# EAGLE schematic MiddleRevolver (EAGLE 7.3.0)
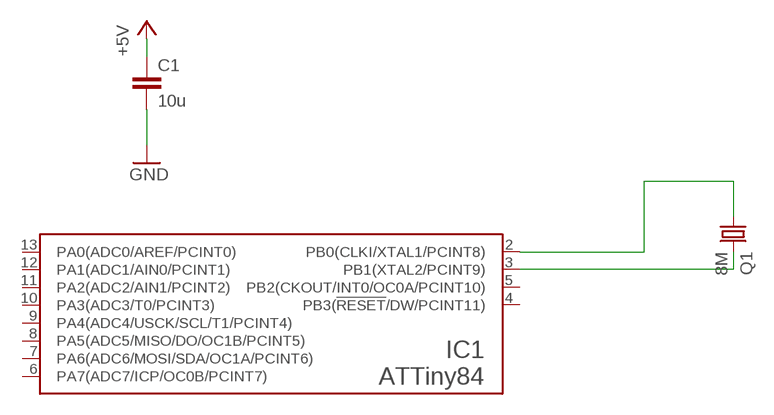
[diagram p0: schematic, sheet 1]

## Parts
C1  10u  C-EUC0805  [C0805]
IC1  ATTiny84  ATTINY24/44/84-PU  [DIL14]
Q1  8M  CRYSTALHC49S  [HC49/S]

## Nets
+5V: C1.1
GND: C1.2
N$1: IC1.2(PB0(CLKI/XTAL1/PCINT8)) Q1.1
N$2: IC1.3(PB1(XTAL2/PCINT9)) Q1.2
Unconnected: IC1.4(PB3(!RESET!/DW/PCINT11)) IC1.5(PB2(CKOUT/INT0/OC0A/PCINT10)) IC1.6(PA7(ADC7/ICP/OC0B/PCINT7)) IC1.7(PA6(ADC6/MOSI/SDA/OC1A/PCINT6)) IC1.8(PA5(ADC5/MISO/DO/OC1B/PCINT5)) IC1.9(PA4(ADC4/USCK/SCL/T1/PCINT4)) IC1.10(PA3(ADC3/T0/PCINT3)) IC1.11(PA2(ADC2/AIN1/PCINT2)) IC1.12(PA1(ADC1/AIN0/PCINT1)) IC1.13(PA0(ADC0/AREF/PCINT0))

## Power pins joined to a net without a drawn wire
GND: IC1.14(GND)
UCC: IC1.1(UCC)

## Library data of the parts
C1 = rcl:C-EU: CAPACITOR, European symbol
IC1 = atmel_tiny24-44-84tiny48-88mega48-88-168-328:ATTINY24/44/84
Q1 = crystal:CRYSTAL: CRYSTAL; OC_FARNELL: 1667008; OC_NEWARK: unknown